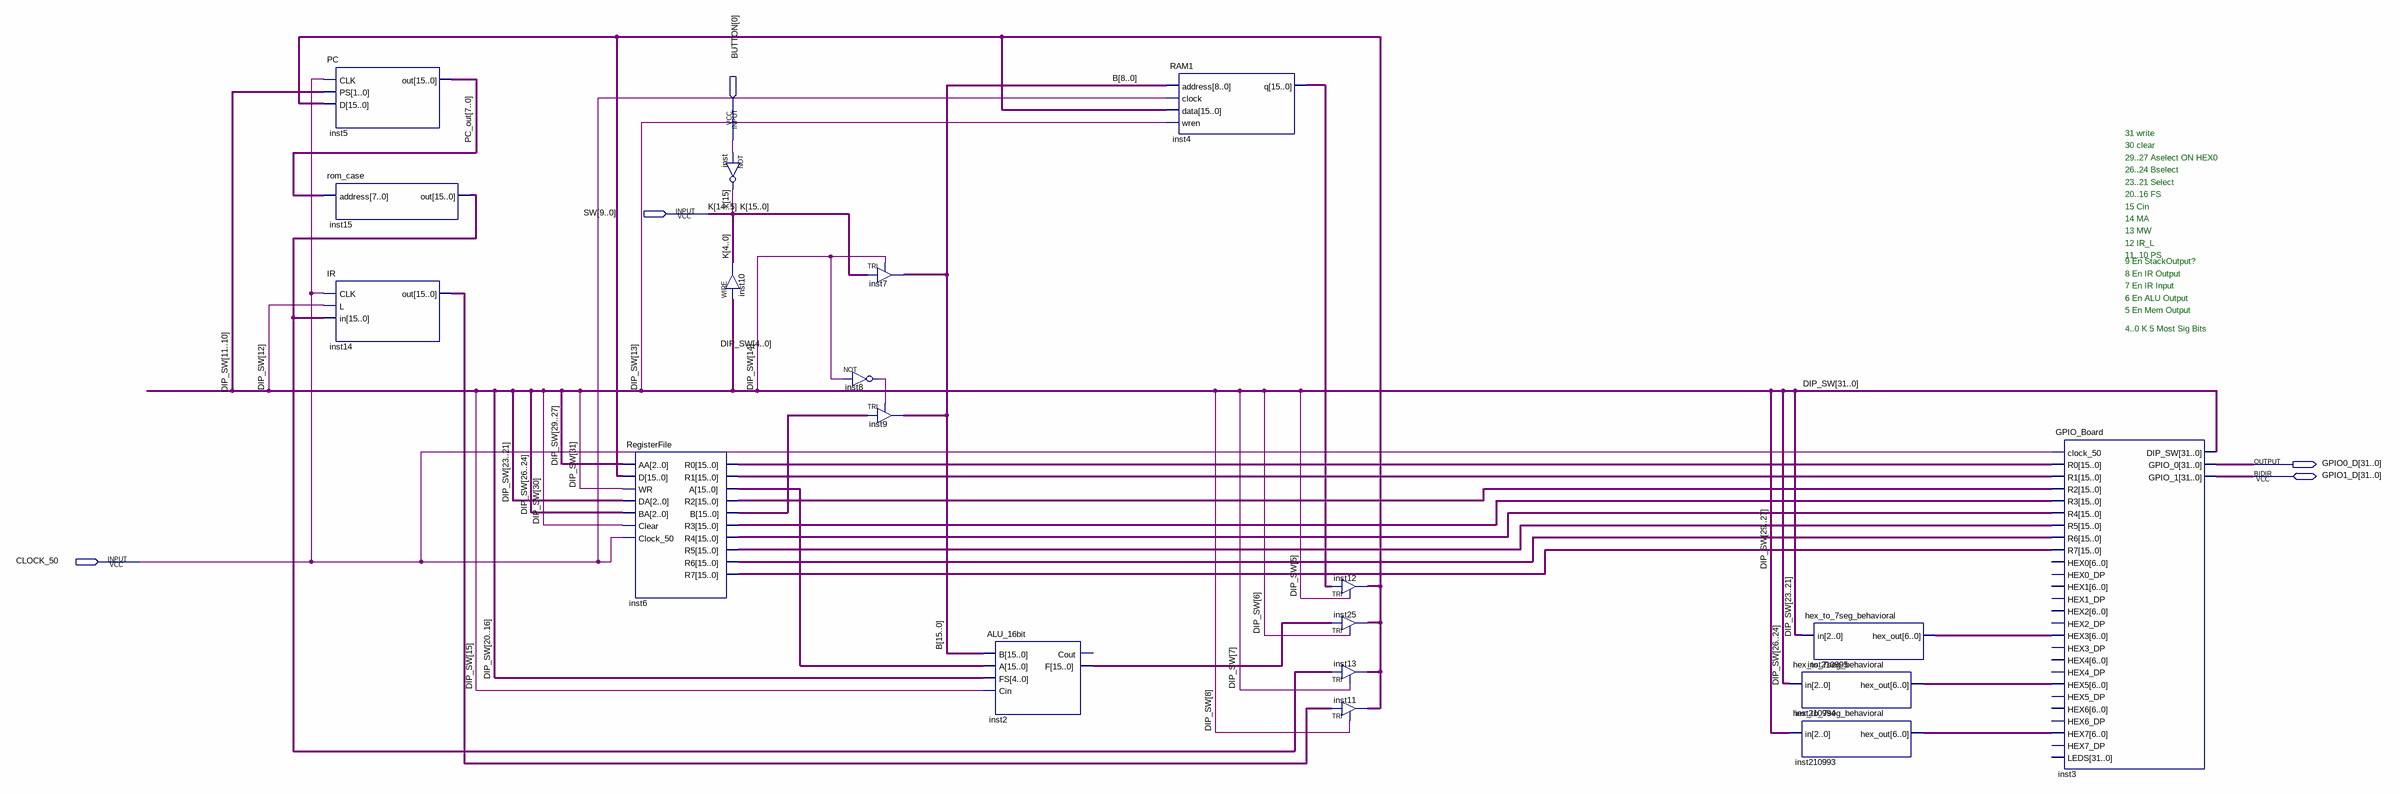
[diagram p0: schematic sheet]
// Quartus schematic Top_Level.bdf as structural Verilog: 19 symbols, 5 pins
module Top_Level (
  input  [0:0] BUTTON,
  input  [9:0] SW,
  input  CLOCK_50,
  inout  [31:0] GPIO1_D,
  output [31:0] GPIO0_D
);

  wire inst8_out, inst_out;
  wire [4:0] K;
  wire [6:0] inst210993_hex_out, inst210994_hex_out, inst210995_hex_out;
  wire [15:0] B, inst2_f, inst4_q, inst6_a, inst6_b, inst6_r0, inst6_r1, inst6_r2, inst6_r3, inst6_r4,
       inst6_r5, inst6_r6, inst6_r7, inst12_out, inst14_out, inst15_out, PC_out;
  wire [31:0] DIP_SW;

  PC inst5 (.CLK(CLOCK_50), .PS(DIP_SW[11:10]), .D(inst12_out), .out(PC_out));
  rom_case inst15 (.address(PC_out[7:0]), .out(inst15_out));
  IR inst14 (.CLK(CLOCK_50), .L(DIP_SW[12]), .in(inst15_out), .out(inst14_out));
  RegisterFile inst6 (
    .AA(DIP_SW[29:27]), .D(inst12_out), .WR(DIP_SW[31]), .DA(DIP_SW[23:21]), .BA(DIP_SW[26:24]),
    .Clear(DIP_SW[30]), .Clock_50(CLOCK_50), .R0(inst6_r0), .R1(inst6_r1), .A(inst6_a), .R2(inst6_r2),
    .B(inst6_b), .R3(inst6_r3), .R4(inst6_r4), .R5(inst6_r5), .R6(inst6_r6), .R7(inst6_r7));
  not inst (inst_out, BUTTON[0]);
  assign K = DIP_SW[4:0];  // WIRE inst10
  not inst8 (inst8_out, DIP_SW[14]);
  TRI inst7[15:0] (.IN({BUTTON[0], SW, K}), .OE(DIP_SW[14]), .OUT(B));
  TRI inst9[15:0] (.IN(inst6_b), .OE(inst8_out), .OUT(B));
  ALU_16bit inst2 (.B(B), .A(inst6_a), .FS(DIP_SW[20:16]), .Cin(DIP_SW[15]), .F(inst2_f));  // open: Cout
  RAM1 inst4 (.address(B[8:0]), .clock(CLOCK_50), .data(inst12_out), .wren(DIP_SW[13]), .q(inst4_q));
  TRI inst12[15:0] (.IN(inst4_q), .OE(DIP_SW[5]), .OUT(inst12_out));
  TRI inst25[15:0] (.IN(inst2_f), .OE(DIP_SW[6]), .OUT(inst12_out));
  TRI inst13[15:0] (.IN(inst15_out), .OE(DIP_SW[7]), .OUT(inst12_out));
  TRI inst11[15:0] (.IN(inst14_out), .OE(DIP_SW[8]), .OUT(inst12_out));
  hex_to_7seg_behavioral inst210995 (.in(DIP_SW[23:21]), .hex_out(inst210995_hex_out));
  hex_to_7seg_behavioral inst210994 (.in(DIP_SW[26:24]), .hex_out(inst210994_hex_out));
  hex_to_7seg_behavioral inst210993 (.in(DIP_SW[29:27]), .hex_out(inst210993_hex_out));
  GPIO_Board inst3 (
    .clock_50(CLOCK_50), .R0(inst6_r0), .R1(inst6_r1), .R2(inst6_r2), .R3(inst6_r3), .R4(inst6_r4),
    .R5(inst6_r5), .R6(inst6_r6), .R7(inst6_r7), .HEX3(inst210995_hex_out), .HEX5(inst210994_hex_out),
    .HEX7(inst210993_hex_out), .DIP_SW(DIP_SW), .GPIO_0(GPIO0_D), .GPIO_1(GPIO1_D));  // open: HEX0, HEX0_DP, HEX1, HEX1_DP, HEX2, HEX2_DP, HEX3_DP, HEX4, HEX4_DP, HEX5_DP, HEX6, HEX6_DP, HEX7_DP, LEDS

  // Other names for the same wires on the sheet: K[15:5] = {BUTTON[0], SW}

  // Notes on the sheet:
  //   31 write
  //   30 clear
  //   29..27 Aselect ON HEX0
  //   26..24 Bselect
  //   23..21 Select
  //   20..16 FS
  //   15 Cin
  //   14 MA
  //   13 MW
  //   12 IR_L
  //   11..10 PS
  //   9 En StackOutput?
  //   8 En IR Output
  //   7 En IR Input
  //   6 En ALU Output
  //   5 En Mem Output
  //   4..0 K 5 Most Sig Bits
endmodule
